# EAGLE design MotoraufsatzschSMD_V1.5 (EAGLE 5.02)
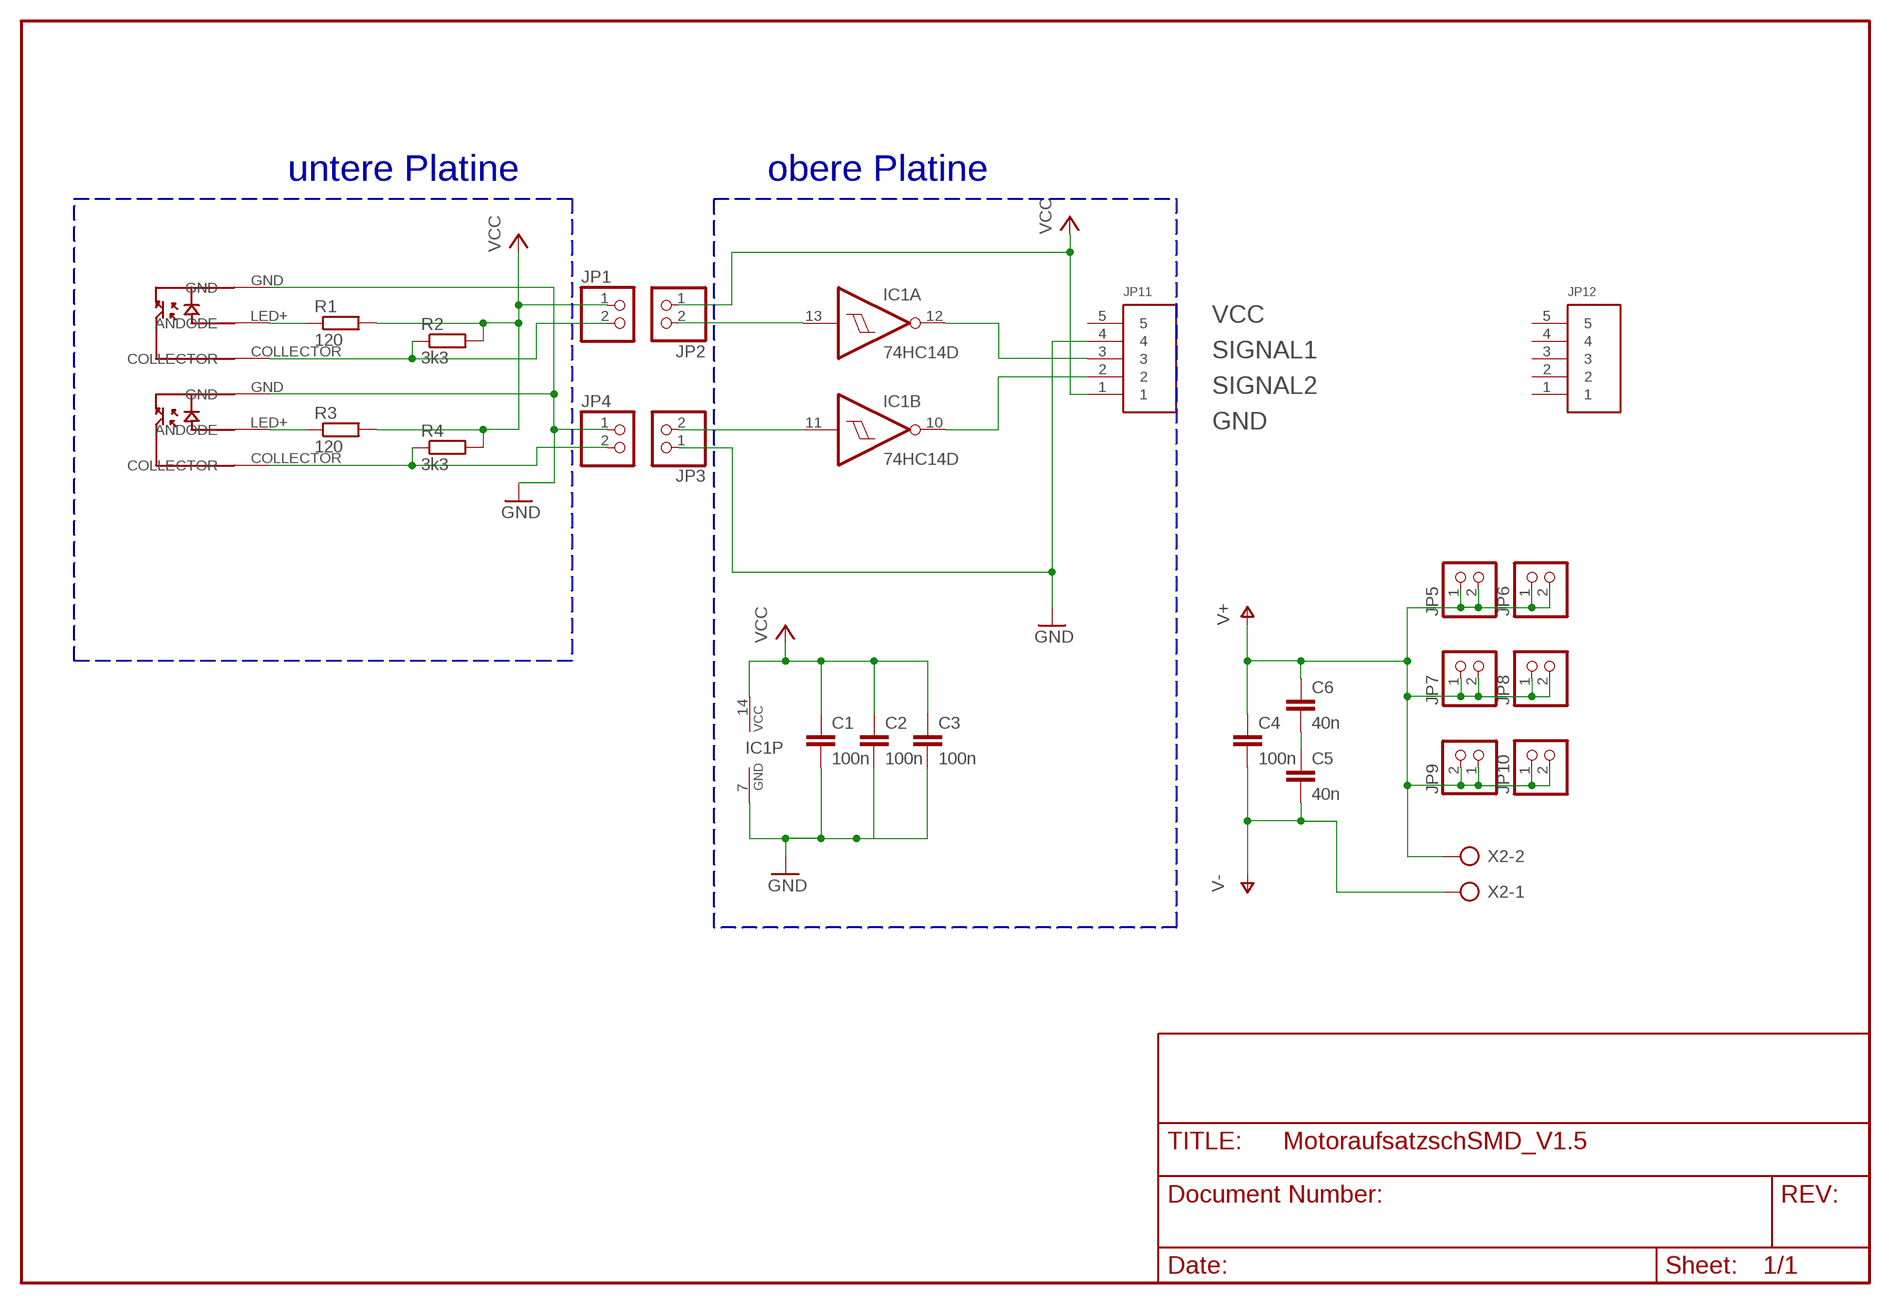
[diagram p0: schematic, sheet 1]

## Parts
C1  100n  C-EUC1206K  [C1206K]
C2  100n  C-EUC1206K  [C1206K]
C3  100n  C-EUC1206K  [C1206K]
C4  100n  C-EU050-024X044  [C050-024X044]
C5  40n  C-EU050-024X044  [C050-024X044]
C6  40n  C-EU050-024X044  [C050-024X044]
IC1  74HC14D  [SO14]
JP1  PINHD-1X2  [1X02]
JP2  PINHD-1X2  [1X02]
JP3  PINHD-1X2  [1X02]
JP4  PINHD-1X2  [1X02]
JP5  PINHD-1X2  [1X02]
JP6  PINHD-1X2  [1X02]
JP7  PINHD-1X2  [1X02]
JP8  PINHD-1X2  [1X02]
JP9  PINHD-1X2  [1X02]
JP10  PINHD-1X2  [1X02]
JP11  5PIN  [B5B-PH-K-S]
JP12  5PIN  [B5B-PH-K-S]
R1  120  R-EU_R0805  [R0805]
R2  3k3  R-EU_R0805  [R0805]
R3  120  R-EU_R0805  [R0805]
R4  3k3  R-EU_R0805  [R0805]
RPI1  RPI-243-LED  [RPI-243-LED]
RPI2  RPI-243-LED  [RPI-243-LED]
X2  AK500/2-H  [AK500/2-H]

## Nets
GND: C1.2 C2.2 C3.2 IC1.7(P:GND) JP3.1 JP4.1 JP11.4 RPI1.GND RPI2.GND
N$1: C5.1 C6.2
N$2: JP4.2 R4.1 RPI2.COLLECTOR
N$4: JP1.2 R2.1 RPI1.COLLECTOR
N$5: R3.1 RPI2.LED+(ANDODE)
N$6: R1.1 RPI1.LED+(ANDODE)
N$10: IC1.11(B:I) JP3.2
N$11: IC1.13(A:I) JP2.2
SIGNAL1: IC1.12(A:O) JP11.3
SIGNAL2: IC1.10(B:O) JP11.2
V+: C4.1 C6.1 JP5.1 JP5.2 JP6.1 JP6.2 JP7.1 JP7.2 JP8.1 JP8.2 JP9.1 JP9.2 JP10.1 JP10.2 X2.2
V-: C4.2 C5.2 X2.1
VCC: C1.1 C2.1 C3.1 IC1.14(P:VCC) JP1.1 JP2.1 JP11.1 R1.2 R2.2 R3.2 R4.2
Unconnected: IC1.1(D:I) IC1.2(D:O) IC1.3(E:I) IC1.4(E:O) IC1.5(F:I) IC1.6(F:O) IC1.8(C:O) IC1.9(C:I) JP11.5 JP12.1 JP12.2 JP12.3 JP12.4 JP12.5

## Buses
B$1
B$2

## Notes on the sheet
- untere Platine | obere Platine

## Library data of the parts
C1-C6 = rcl:C-EU: CAPACITOR, European symbol
IC1 = 74xx-eu:74*14: Hex schmitt trigger INVERTER
JP1-JP10 = pinhead:PINHD-1X2: PIN HEADER
JP11 JP12 = jst_eph:5PIN
R1-R4 = rcl:R-EU_: RESISTOR, European symbol
RPI1 RPI2 = olaf:RPI-243-LED
X2 = con-ptr500:AK500/2-H: CONNECTOR Aug. 2004 / PTR Meßtechnik: Die Bezeichnung der Serie AK505 wurde geändert. Es handelt sich hierbei um AK500 in horizontaler Ausführung.

## Board
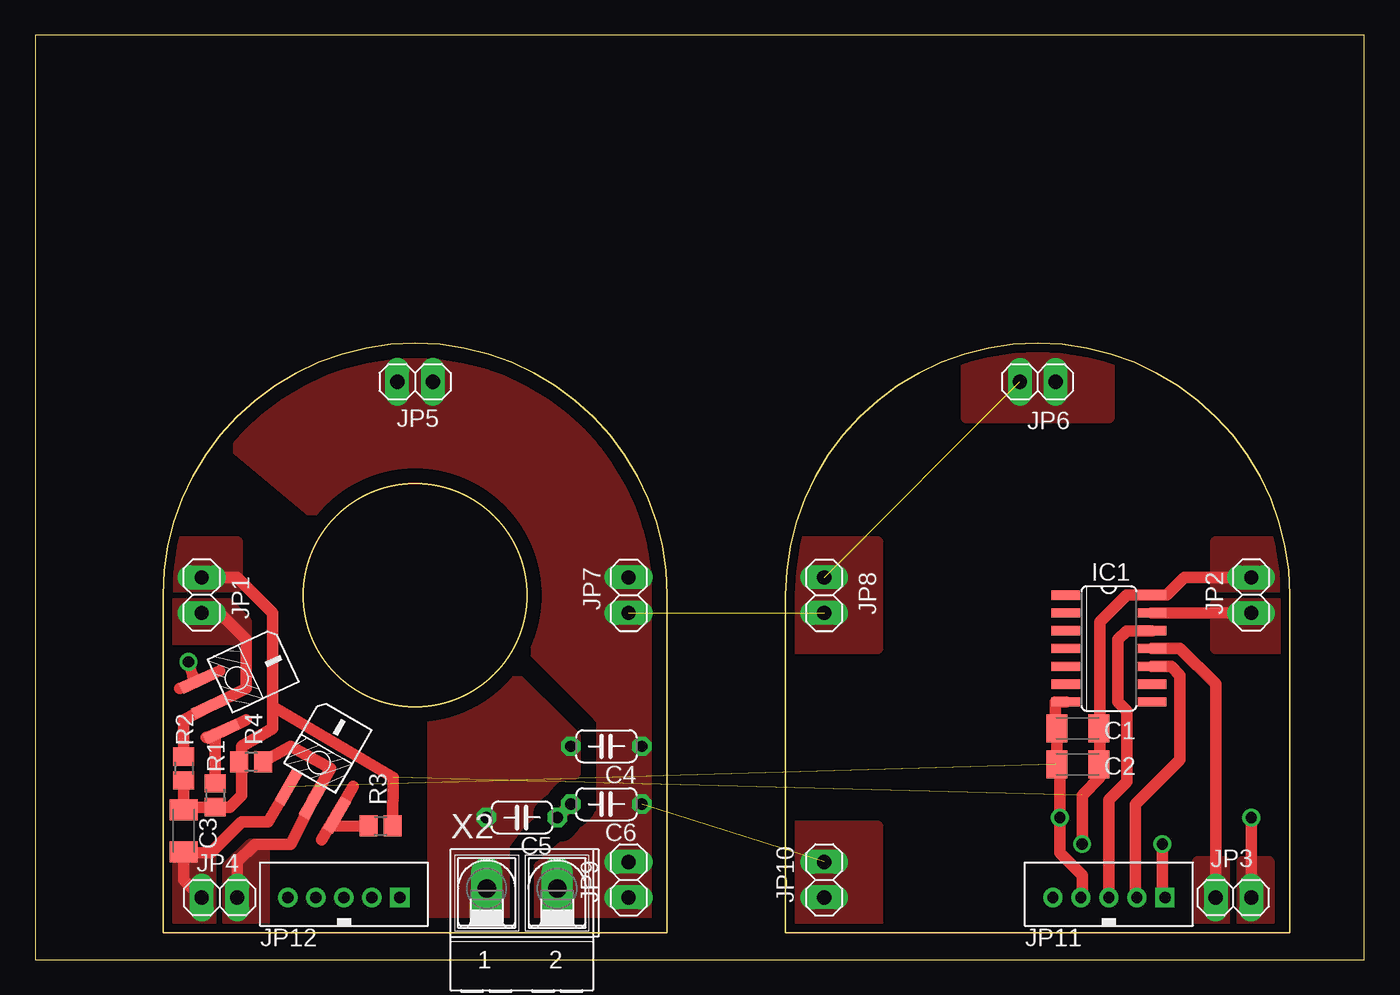
[diagram p1: board, top side]
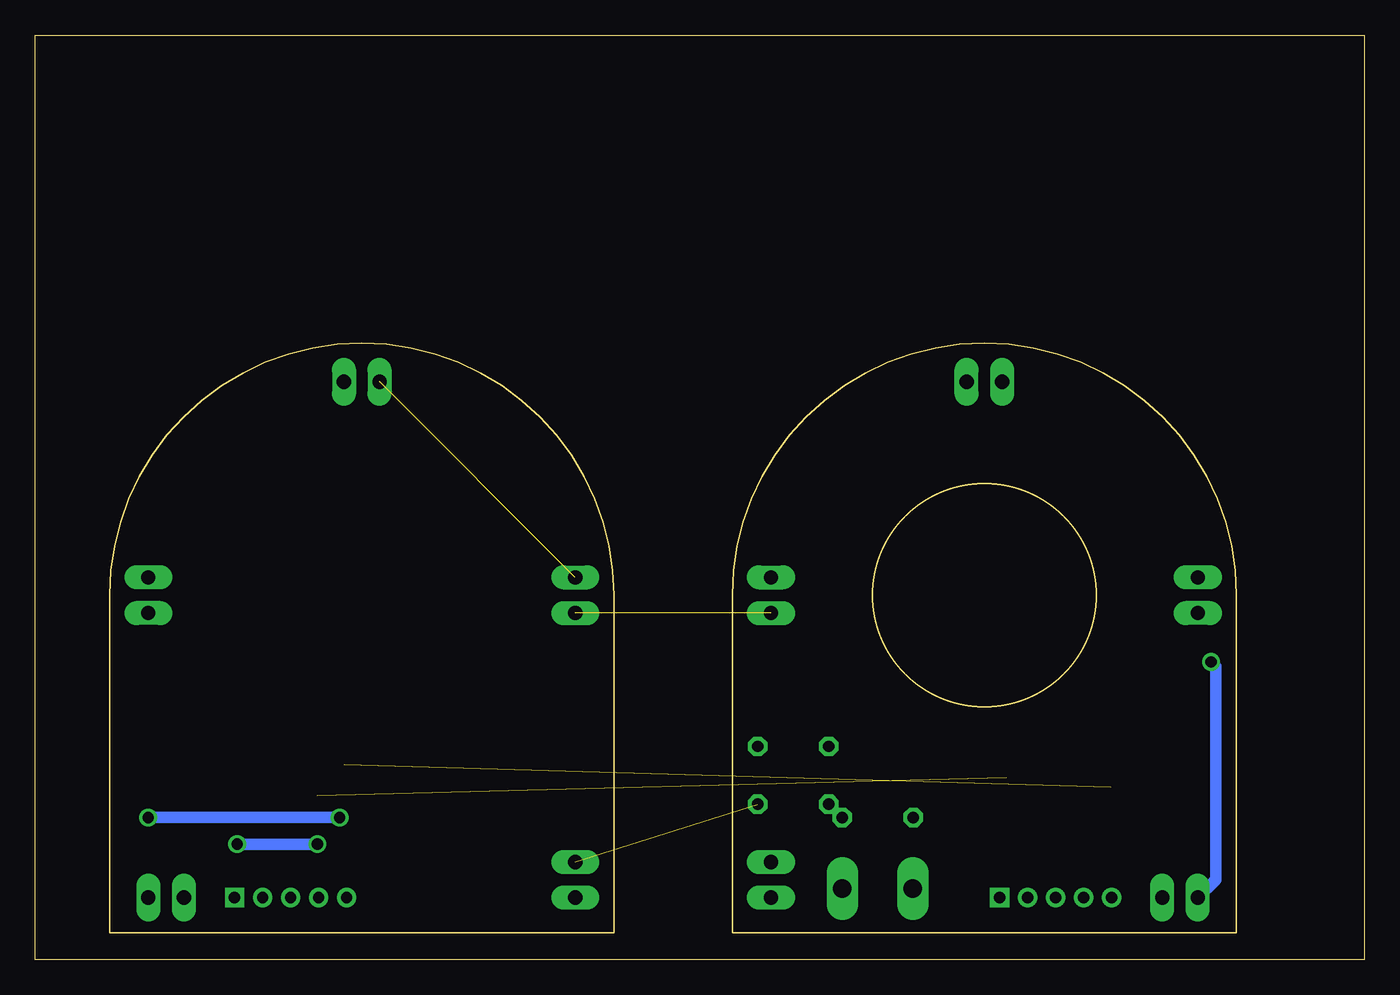
[diagram p2: board, bottom side, seen from below]

Size 94.92 x 66.03 mm. Coordinates in mm from the lower left corner, seen from the top.
Outline: 0,0 94.92,0 94.92,66.03 0,66.03 0,0
Outline: 89.59,26.03 arc180 53.59,26.03 53.59,1.9 89.59,1.9 89.59,26.03
Outline: 9.14,26.03 arc-180 45.14,26.03 45.14,1.9 9.14,1.9 9.14,26.03
Outline: circle at 27.14,26.03 radius 7.97
Copper layers (1*16): Top 0.035mm / dielectric 1.5mm / Bottom 0.035mm
Design rules "default *": minimum track width 32mil, minimum drill 24mil, track to track 16mil, track to pad 16mil, pad to pad 16mil, via to via 16mil, smd to smd 16mil, copper to edge 24mil, drill to drill 8mil, minimum pad ring 10mil, minimum via ring 8mil, stop-mask expansion 4mil, vias tented up to drill 0mil, thermal gap 10mil

### Footprints (pad centres in the part's own frame; a part is rotated, then mirrored left to right if it is on the bottom)
C1206K = smd 1.5 x 2: 1 -1.5,0; 2 1.5,0
C050-024X044 = drill 0.813 octagon: 1 -2.54,0; 2 2.54,0
SO14 = smd 0.66 x 2.032: 1 -3.81,-3.073; 2 -2.54,-3.073; 3 -1.27,-3.073; 4 0,-3.073; 5 1.27,-3.073; 6 2.54,-3.073; 7 3.81,-3.073; 8 3.81,3.073; 9 2.54,3.073; 10 1.27,3.073; 11 0,3.073; 12 -1.27,3.073; 13 -2.54,3.073; 14 -3.81,3.073
1X02 = drill 1.016 long: 1 -1.27,0; 2 1.27,0
B5B-PH-K-S = drill 0.813 square: 1 4,0 | drill 0.813 round: 2 2,0; 3 0,0; 4 -2,0; 5 -4,0
R0805 = smd 1.3 x 1.5: 1 -0.85,0; 2 0.85,0
RPI-243-LED = smd 0.8 x 2.6: COLLECTOR 1,-6.5; GND -1,-6.5; LED+ 3,-6.5
AK500/2-H = drill 1.321 long: 1 -2.515,0; 2 2.515,0

### Placement (x,y rotation side)
C1  74.45,16.5 180 top
C2  74.45,13.97 180 top
C3  10.63,9.2 270 top
C4  40.79,15.24 180 top
C5  34.76,10.16 180 top
C6  40.79,11.11 180 top
IC1  76.67,22.22 270 top
JP1  11.9,26.03 270 top
JP2  86.83,26.03 270 top
JP3  85.56,4.44 180 top
JP4  13.17,4.44 0 top
JP5  27.14,41.27 0 top
JP6  71.59,41.27 180 top
JP7  42.38,26.03 90 top
JP8  56.35,26.03 90 top
JP9  42.38,5.71 90 top
JP10  56.35,5.71 90 top
JP11  76.67,4.44 0 top
JP12  22.06,4.44 0 top
R1  12.85,11.74 270 top
R2  10.63,13.65 270 top
R3  24.67,9.56 0 top
R4  15.44,14.12 180 top
RPI1  17.93,21.74 295 top
RPI2  22.22,17.46 330 top
X2  34.76,5.08 0 top

### Tracks (layer width: path | path; a pad name or v marks a point on that pad's centre or on a via)
GND  (via drill 0.8 pad 1.27)  (1 unrouted)
  Top 0.813: v86.83,10.16 JP3.1 | 72.86,13.97 72.95,14.05 C1.2 72.86,16.5 72.86,18.41 IC1.7 | RPI2.GND 16.66,9.84 14.76,9.84 12.54,7.62 11.27,7.62 10.63,7.93 C3.2 10.63,5.71 JP4.1 | 13.17,20.63 10.31,19.36 RPI1.GND 11.62,19.96 arc90 11.58,20 arc-90 11.27,20.31 v10.95,21.27 | 72.86,13.97 C2.2 | 72.86,13.97 73.18,13.01 v73.18,10.16 73.18,7.62 74.77,6.03 74.77,4.54 JP11.4
  Bottom 0.813: v73.18,10.16 v86.83,10.16 | JP4.1 10.63,5.71 10.63,20.95 v10.95,21.27
  pour Top (no thermals): 86.19,6.98 88.1,6.98 88.1,1.9 86.19,1.9
  pour Top (no thermals): 9.36,1.9 9.36,7.62 12.54,7.62 12.54,1.9
N$1
  Top 0.813: C5.1 C6.2
N$2
  Top 0.813: JP4.2 14.44,6.98 15.71,8.25 18.25,8.25 RPI2.COLLECTOR 19.84,11.43 21.11,13.65 18.25,15.24 16.82,14.44 R4.1
  pour Top (no thermals): 16.34,1.9 13.81,1.9 13.81,6.66 15.39,8.25 16.34,8.25 16.34,6.66
N$4
  Top 0.813: JP1.2 13.17,24.76 15.08,22.86 15.08,19.36 RPI1.COLLECTOR 10.63,17.14 R2.1
  pour Top (no thermals): 9.36,22.86 9.36,25.39 13.81,25.39 15.08,24.12 15.08,22.86
N$5
  Top 0.813: RPI2.LED+ 22.7,12.38 21.05,9.56 | 20.47,8.57 21.05,9.56 | 21.05,9.56 21.11,9.52 R3.1
N$6
  Top 0.813: RPI1.LED+ 15.08,17.14 12.75,16.11 | 12.75,16.11 12.22,15.87 | 12.75,16.11 12.85,15.87 R1.1
N$10
  Top 0.813: IC1.11 81.75,22.22 84.29,19.68 JP3.2
  pour Top (no thermals): 83.02,1.9 84.92,1.9 84.92,6.98 83.02,6.98
N$11
  Top 0.813: IC1.13 JP2.2
  pour Top (no thermals): 89.37,22.22 89.37,25.39 84.29,25.39 84.29,22.22
SIGNAL1
  Top 0.813: IC1.12 77.94,23.49 77.3,22.86 77.3,18.41 77.94,17.77 77.94,12.7 76.67,11.43 JP11.3
SIGNAL2
  Top 0.813: IC1.10 81.11,20.95 81.75,20.31 81.75,14.28 78.58,11.11 78.58,4.54 JP11.2
V+  (3 unrouted)
  pour Top (isolate 1.016, rank 2, no thermals): 44.92,1.9 36.03,1.9 36.03,6.66 40.48,10.47 40.48,17.14 34.76,22.86 34.76,28.57 32.22,32.38 27.14,33.97 23.33,33.02 21.42,31.74 20.79,31.11 13.17,37.46 18.25,42.54 24.6,43.81 30.95,43.81 37.3,41.27 41.11,37.46 43.65,33.65 44.92,28.57
  pour Top (no thermals): 53.81,29.84 60.16,29.84 60.16,22.22 53.81,22.22
  pour Top (no thermals): 53.81,9.52 60.16,9.52 60.16,1.9 53.81,1.9
  pour Top (no thermals): 66.51,43.81 66.51,38.73 76.67,38.73 76.67,43.81
V-
  pour Top (isolate 1.016, no thermals): 28.41,18.41 28.41,1.9 33.49,1.9 33.49,8.25 34.44,9.52 38.57,13.33 38.57,15.91 33.49,20.95 arc-48
VCC  (via drill 0.8 pad 1.27)  (1 unrouted)
  Top 0.813: JP2.1 82.07,27.3 80.8,26.03 IC1.14 77.94,26.03 76.03,24.12 76.03,16.59 C1.1 76.03,16.5 76.03,14.05 C2.1 76.03,13.97 76.03,13.01 74.77,11.74 v74.77,8.25 | 10.63,10.79 R2.2 | C3.1 10.63,10.79 | 10.63,10.79 10.73,10.89 R1.2 13.91,10.89 14.76,11.74 14.76,14.44 | JP1.1 14.44,27.3 16.98,24.76 16.98,18.09 | JP11.1 80.48,4.63 v80.48,8.25 | R3.2 25.55,13.01 16.98,18.09 | 14.76,14.44 R4.2 | 14.76,14.44 14.76,15.24 16.98,16.5 16.98,18.09
  Bottom 0.813: v80.48,8.25 v74.77,8.25
  pour Top (no thermals): 89.37,29.84 89.37,26.66 84.29,26.66 84.29,29.84
  pour Top (no thermals): 9.36,29.84 9.36,26.66 14.44,26.66 14.44,29.84

### Text on the board
Measures: 65° | 30°
Document: Ausßenkontur 36mm | Schlitzscheibe 25mm | Lager 16mm | GND | GND | SIGNAL_A | SIGNAL_B | VCC